# Altium schematic sheet EEM_connector.SchDoc: Fast Servo
size 297 x 209 mm; Author: G.Kasprowicz; CompanyName: WUT ISE; DrawnBy: G.Kasprowicz; Organization: WUT ISE; Address1: PW ISE; Address2: Nowowiejska 15/19 00-665 Warsaw; Address3: gkasprow@gmail.com; DocumentNumber: 16; Revision: 1.0; SheetNumber: 16; SheetTotal: 33; ModifiedBy: -; CheckedDate: -; Title2: EEM connector & drivers; DivGrp: WUT ISE; Designer: G.Kasprowicz; ModifiedDate: -; ProjectName: Sensor Box
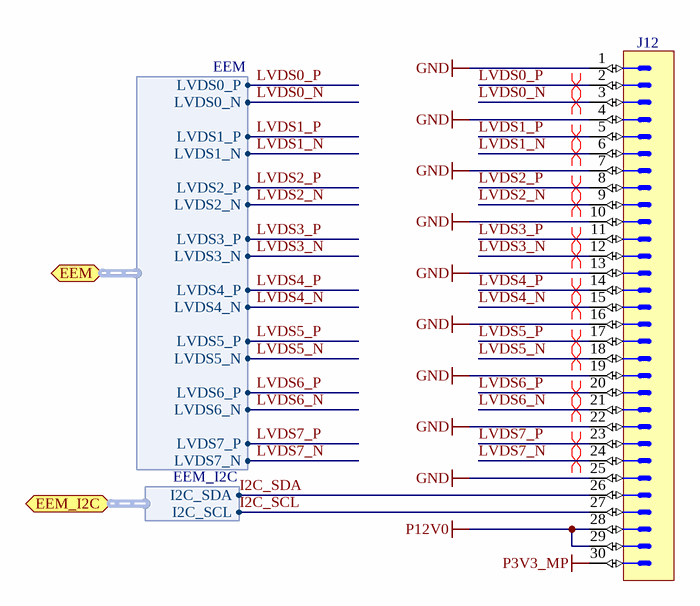
[diagram p0: EEM_connector.SchDoc]

## Parts
J12  (no value)  [3M_N2530-6002RB]

## Ports
EEM (bidir, harness EEM), EEM_I2C (bidir, harness EEM_I2C)

## Harnesses
EEM: LVDS0_P, LVDS0_N, LVDS1_P, LVDS1_N, LVDS2_P, LVDS2_N, LVDS3_P, LVDS3_N, LVDS4_P, LVDS4_N, LVDS5_P, LVDS5_N, LVDS6_P, LVDS6_N, LVDS7_P, LVDS7_N
EEM_I2C: I2C_SDA, I2C_SCL

## Nets
GND: J12.1 J12.4 J12.7 J12.10 J12.13 J12.16 J12.19 J12.22 J12.25
P3V3_MP: J12.30
P12V0: J12.28 J12.29
I2C_SCL: J12.27 ; port EEM_I2C.I2C_SCL
I2C_SDA: J12.26 ; port EEM_I2C.I2C_SDA
LVDS0_N: J12.3 ; port EEM.LVDS0_N
LVDS0_P: J12.2 ; port EEM.LVDS0_P
LVDS1_N: J12.6 ; port EEM.LVDS1_N
LVDS1_P: J12.5 ; port EEM.LVDS1_P
LVDS2_N: J12.9 ; port EEM.LVDS2_N
LVDS2_P: J12.8 ; port EEM.LVDS2_P
LVDS3_N: J12.12 ; port EEM.LVDS3_N
LVDS3_P: J12.11 ; port EEM.LVDS3_P
LVDS4_N: J12.15 ; port EEM.LVDS4_N
LVDS4_P: J12.14 ; port EEM.LVDS4_P
LVDS5_N: J12.18 ; port EEM.LVDS5_N
LVDS5_P: J12.17 ; port EEM.LVDS5_P
LVDS6_N: J12.21 ; port EEM.LVDS6_N
LVDS6_P: J12.20 ; port EEM.LVDS6_P
LVDS7_N: J12.24 ; port EEM.LVDS7_N
LVDS7_P: J12.23 ; port EEM.LVDS7_P

## Layout directives
differential pair: LVDS0_N, LVDS0_P, LVDS1_N, LVDS1_P, LVDS2_N, LVDS2_P, LVDS3_N, LVDS3_P, LVDS4_N, LVDS4_P, LVDS5_N, LVDS5_P, LVDS6_N, LVDS6_P, LVDS7_N, LVDS7_P

## Notes on the sheet
- Project
- Document
- Designer
- Drawn by
- Check.by
- File
- Last Mod.
- Print Date
- Sheet
- Size
- A4
- of
- Rev

## Library data of the parts
J12 = 3M_N2530-6002RB: Connector 30 Male; Part Description: 30 Contacts - Straight .100'' x .100'' Low Profile Four-Wall Header, 2500 Series; Manufacturer: 3M; PressFit: No; Part Number: 3M_N2530-6002RB; Component Kind: Standard; Component Type: Standard; Pin Count: 30; Family: Header 30; Mounted: Yes; Socket: No; SMD: No; Sense: No; Status: None; Manufacturer Part Number: N2530-6002RB; ComponentHeight: 10.03mm; HelpURL: \\cern.ch\dfs\Applications\Altium\Datasheets\3M_N2530-6002RB.pdf; Author: CERN DEM JLC; CreateDate: 11.02.2009; LatestRevisionDate: 11.08.2009